# EAGLE schematic cherrymx_rgb_breakout (EAGLE 9.6.0)
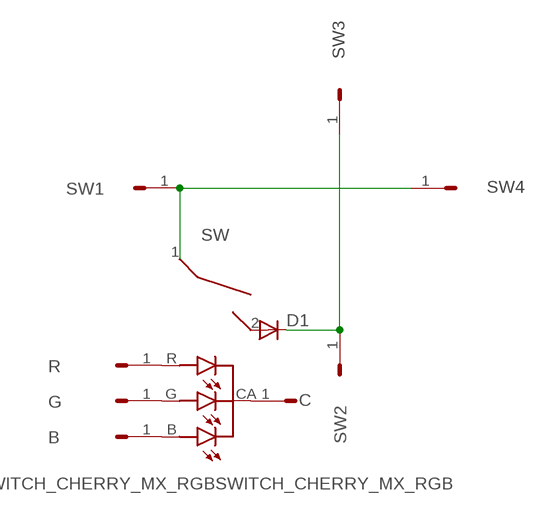
[diagram p0: schematic, sheet 1]

## Parts
B  HEADER/MALE/01  [HEADER/MALE/01]
C  HEADER/MALE/01  [HEADER/MALE/01]
D1  1N4148DO35-7  [DO35-7]
G  HEADER/MALE/01  [HEADER/MALE/01]
R  HEADER/MALE/01  [HEADER/MALE/01]
SW  SWITCH_CHERRY_MX_RGBSWITCH_CHERRY_MX_RGB  [SWITCH_CHERRY_MX_RGB]
SW1  HEADER/MALE/01  [HEADER/MALE/01]
SW2  HEADER/MALE/01  [HEADER/MALE/01]
SW3  HEADER/MALE/01  [HEADER/MALE/01]
SW4  HEADER/MALE/01  [HEADER/MALE/01]

## Nets
N$1: SW1.1 SW4.1 SW.1
N$2: D1.A SW.2
N$3: B.1 SW.B(B-CAT)
N$4: G.1 SW.G(G-CAT)
N$5: R.1 SW.R(R-CAT)
N$6: C.1 SW.CA(COMMON-ANODE)
N$7: D1.C SW2.1 SW3.1

## Library data of the parts
B C G R SW1-SW4 = connectors:HEADER/MALE/01
D1 = transistors:1N4148: DIODE high speed (Philips)
SW = controls:SWITCH_CHERRY_MX_RGB